# EAGLE design M5amigo-RS-485-MAX485 (EAGLE 9.6.2)

## Sheet 1 of 2
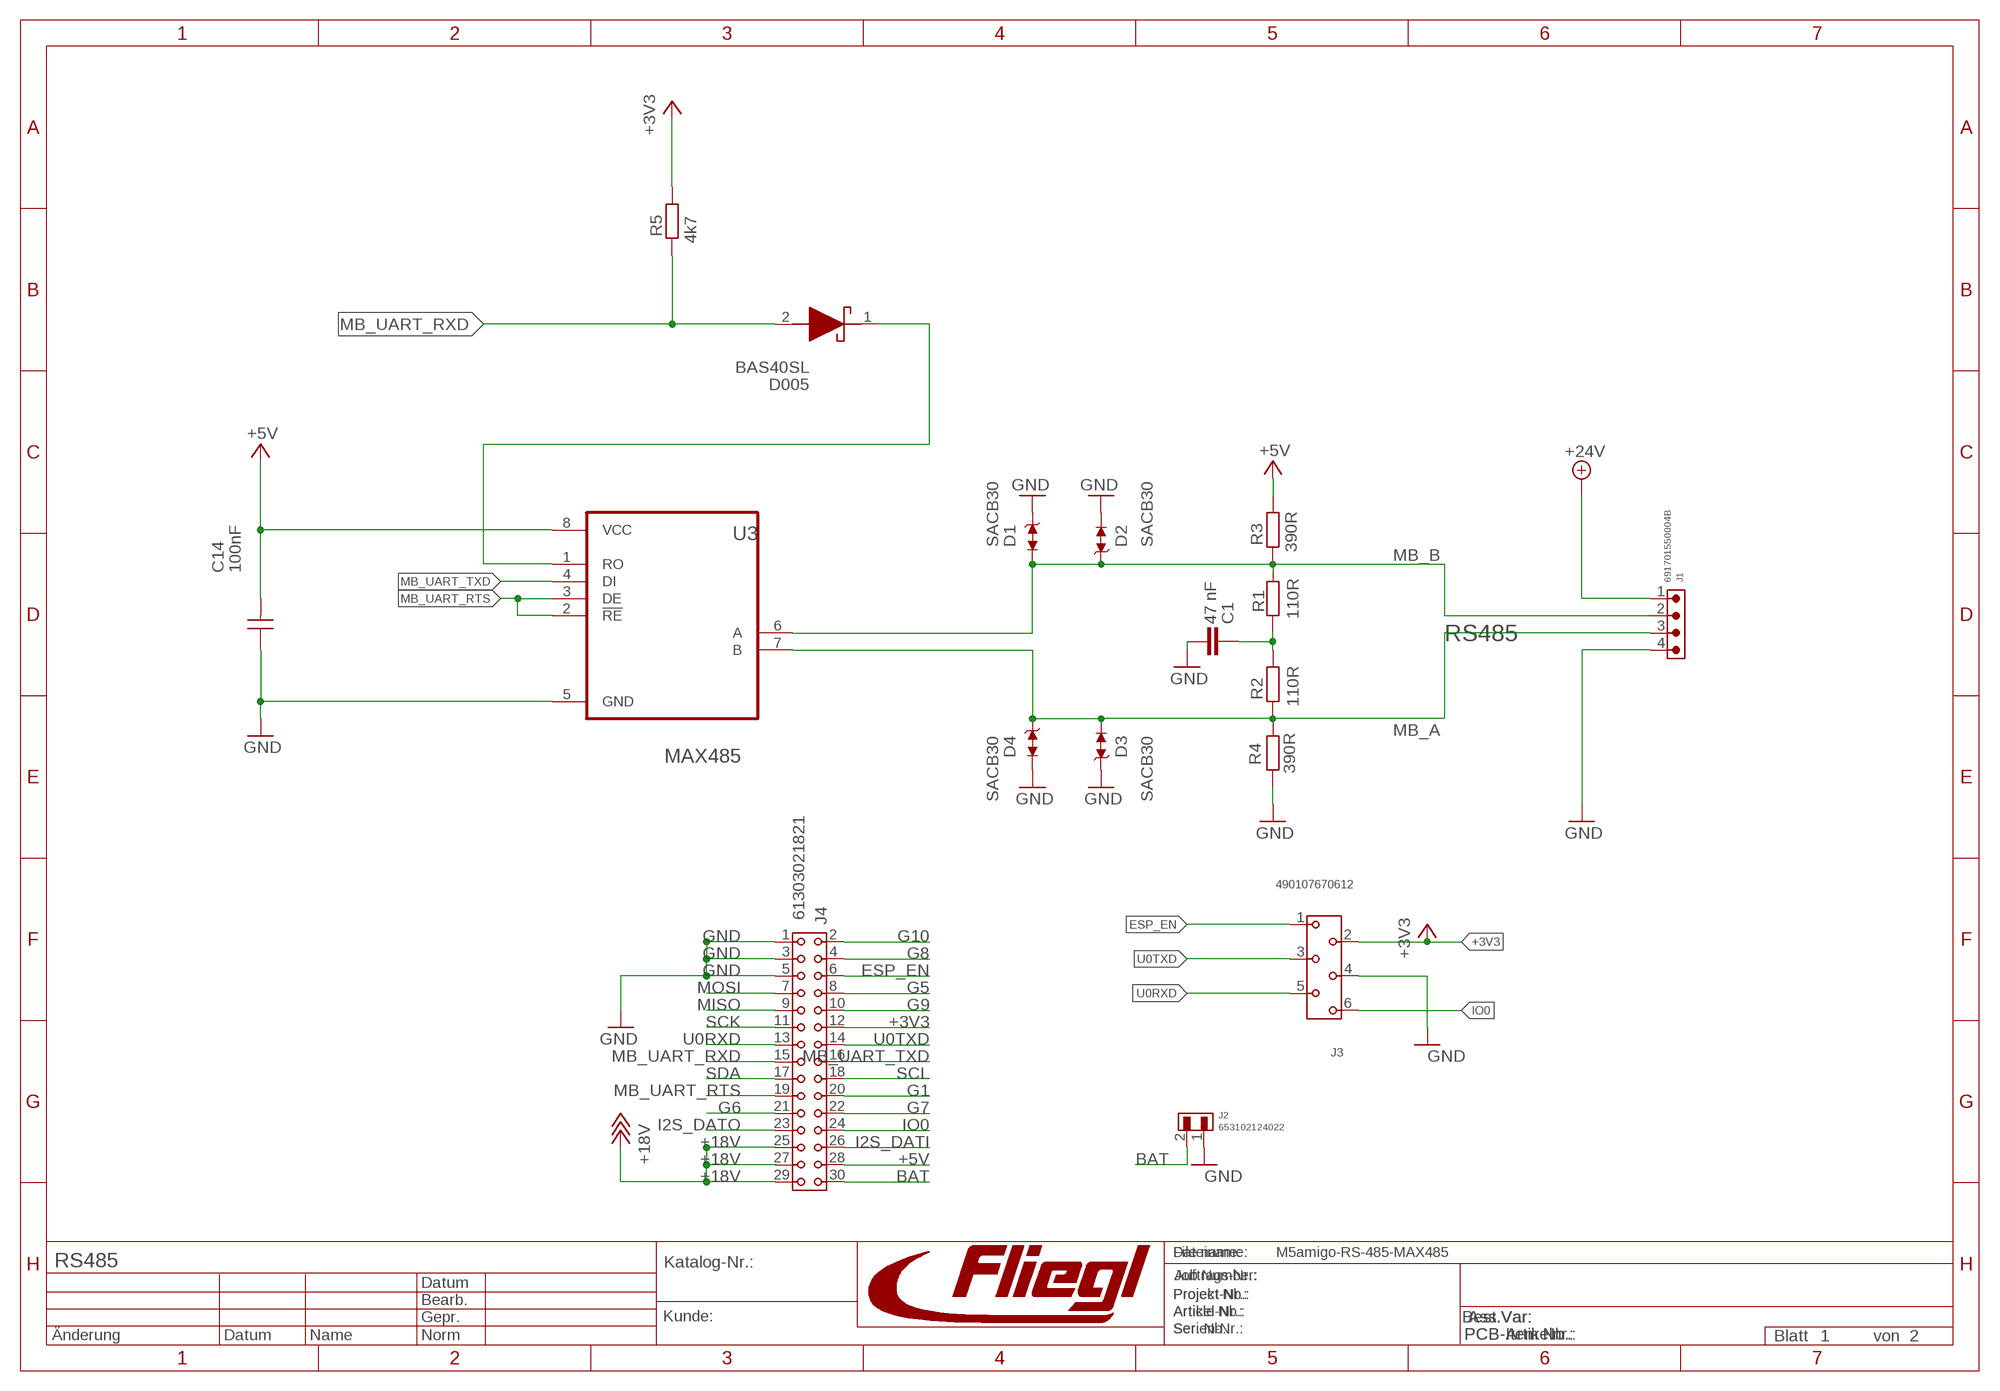
[diagram p0: schematic, sheet 1]
ZEICHNUNGSRAHMEN1 (RAHMEN_A4): FUNKTION: RS485

### Parts
C1  47 nF  WCAP-CSGP_0402_885012205054_25V(DC)  [WCAP-CSGP_0402]
C14  100nF  WCAP-CSGP_1206_H0.8_885012208087_50V(DC)  [WCAP-CSGP_1206_H0.8]
D1  SACB30  [DO214AA]
D2  SACB30  [DO214AA]
D3  SACB30  [DO214AA]
D4  SACB30  [DO214AA]
D005  BAS40SL  [SODFL1006X43N]
J1  691701550004B  [691701550004B]
J2  653102124022  [653102124022]
J3  490107670612  490107670612_DEBUGGING  [490107670612_DEBUGGING]
J4  61303021821  6130XX21821_61303021821  [61303021821]
R1  110R  R-0402_110R  [WCAP-CSRF_0402]
R2  110R  R-0402_110R  [WCAP-CSRF_0402]
R3  390R  R-0603_390R  [WCAP-CSMH_0603_R]
R4  390R  R-0603_390R  [WCAP-CSMH_0603_R]
R5  4k7  R-0603_390R  [WCAP-CSMH_0603_R]
U3  MAX485  MAX3485ECSA+T  [SOIC127P600X175-8N]

### Nets
+3V3: J3.2 J4.12 R5.2
+5V: C14.2 J4.28 R3.2 U3.8(VCC)
+18V: J4.25 J4.27 J4.29 ; also sheet 2
+24V: J1.1 ; also sheet 2
BAT: J2.2 J4.30
ESP_EN: J3.1 J4.6
G1: J4.20
G5: J4.8
G6: J4.21
G7: J4.22
G8: J4.4
G9: J4.10
G10: J4.2
GND [Versorgung]: C1.2 C14.1 D1.C(K) D2.A(KD) D3.C(K) D4.A(KD) J1.4 J2.1 J3.4 J4.1 J4.3 J4.5 R4.1 U3.5(GND) ; also sheet 2
I2S_DATI: J4.26
I2S_DATO: J4.23
IO0: J3.6 J4.24
MB_A: D3.A(KD) D4.C(K) J1.3 R2.1 R4.2 U3.7(B)
MB_B: D1.A(KD) D2.C(K) J1.2 R1.2 R3.1 U3.6(A)
MB_UART_RTS: J4.19 U3.2(!RE) U3.3(DE)
MB_UART_RXD: D005.2(A) J4.15 R5.1
MB_UART_TXD: J4.16 U3.4(DI)
MISO: J4.9
MOSI: J4.7
N$2: D005.1(K) U3.1(RO)
N$3: C1.1 R1.1 R2.2
SCK: J4.11
SCL: J4.18
SDA: J4.17
U0RXD: J3.5 J4.13
U0TXD: J3.3 J4.14

### Notes on the sheet
- RS485

## Sheet 2 of 2
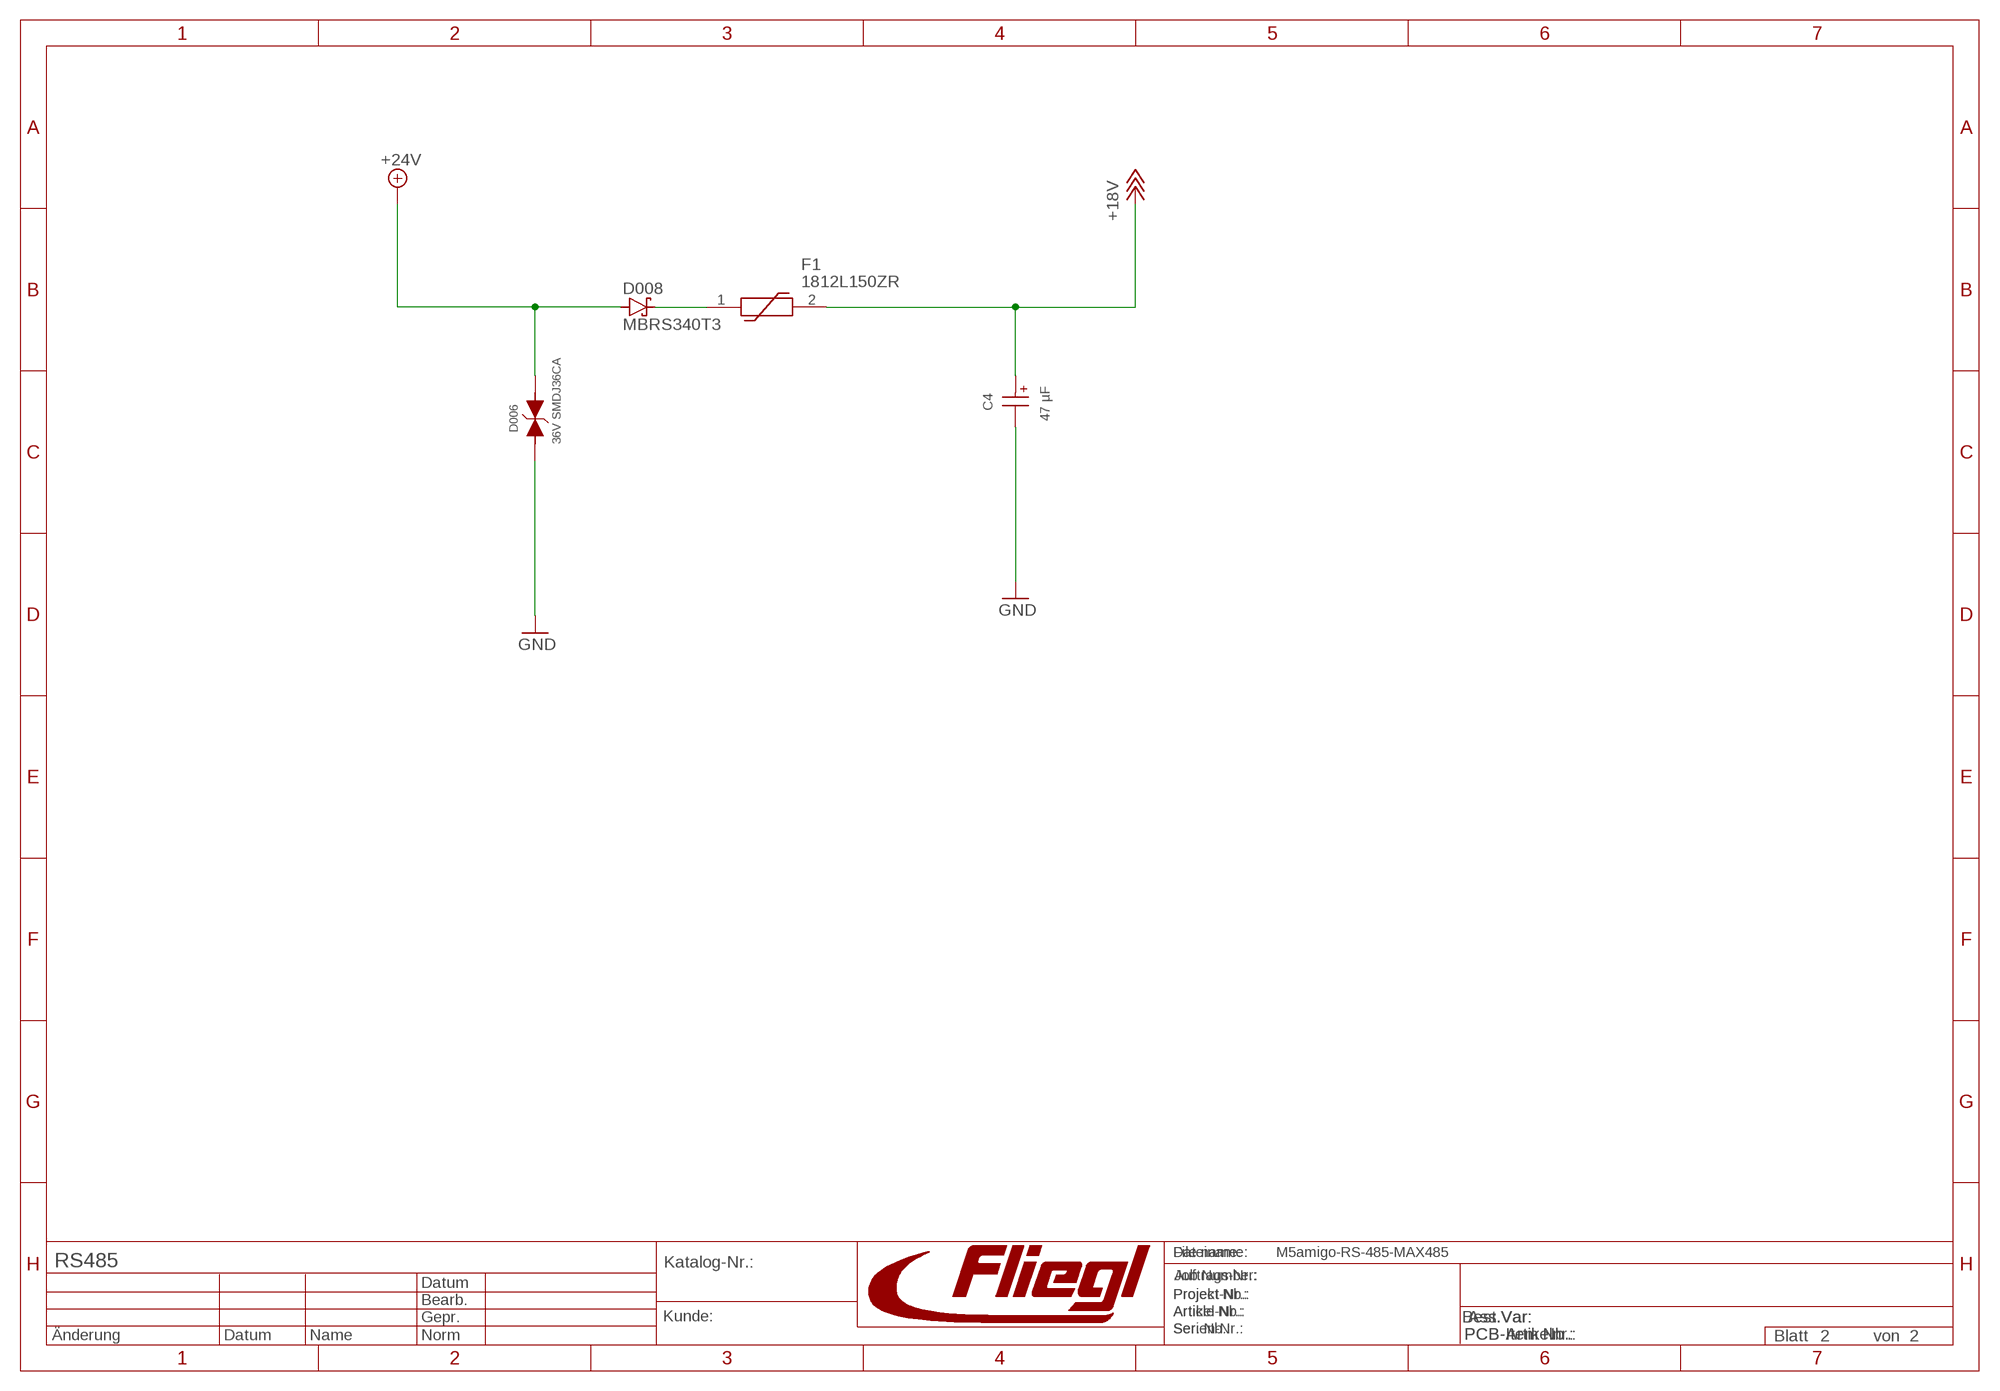
[diagram p1: schematic, sheet 2]
ZEICHNUNGSRAHMEN2 (RAHMEN_A4): FUNKTION: RS485

### Parts
C4  47 µF  WCAP-ASLL_6.3X7.7_865060645008  [WCAP-ASLL_6.3X7.7(DXL)]
D006  36V SMDJ36CA  WE-TVSP_DO-214AB_3000W_BI_824551361  [WE-TVSP_DO-214AB_BIDIRECTIONAL]
D008  MBRS340T3  [SMC]
F1  1812L150ZR  [1812L010DR]

### Nets
+18V: C4.1(+) F1.2 ; also sheet 1
+24V: D006.2 D008.A ; also sheet 1
GND [Versorgung]: C4.2(-) D006.1 ; also sheet 1
N$1: D008.C F1.1

## Library data of the parts
C1 = fliegl-wuerth:WCAP-CSGP_0402: WCAP-CSGP MLCCs 0402 General Purpose Characteristics High performance ceramic High electrical precision and stability ceramic especially for NP0 Minimal aging especially for NP0 Mounting style: SMT-Chip Ceramic: NP0 (Class I), X5R (Class II), X7R (Class II) Capacitance range: 1 pF ‒ 10 µF Temperature Coefficient: ±30 ppm/°C; ±0.54 % for NP0 ±15 % for X5R and X7R Voltage range (UR): 6.3 ‒ 100 V(DC) Operating temperature: -55 °C up to + 125 °C for NP0 and X7R -55 °C up to + 85 °C for X5R Termination: Cu/Ni/Sn Recommended soldering: Reflow soldering Applications Temperature compensation (NP0) Coupling Decoupling Bypass Smoothing Filtering Resonant circuit <https://www.we-online.com/catalog/media/o157810v209%20Family_WE-MLCC_0805_weiss.jpg> Details see: https://www.we-online.com/catalog/en/WCAP-CSGP-0402/ Updated by yingchun,Shan;2020-03-06 2020(C) Würth Elektronik; ARTIKEL_NR: 545508; CERAMIC-TYPE: X7R Class II; PART-NUMBER: 885012205054; TOL-VALUE: ±10%; VR: 25V(DC)
C4 = Wurth_Capacitors_WCAP-ASLL:WCAP-ASLL_6.3X7.7: WCAP-ASLL Aluminium Electrolytic Capacitors Low Impedance & Long Life +105 °C Characteristics Low impedance and long life product series Mounting style: V-Chip SMT Capacitance range: 1 µF ‒ 6800 µF Capacitance tolerance: ±20 % Voltage range (UR): 6.3 ‒ 450 V(DC) Operating temperature: -55 °C up to +105 °C for UR ≤ 100 V(DC) -40 °C up to +105 °C for UR > 100 V(DC) Endurance: 2000 ‒ 5000 h @ +105 °C Dimensions (DxL) in mm: 4.0 x 5.5 up to 16.0 x 17.0 Recommended soldering: Reflow soldering Applications Long life application & low impedance Input and output capacitor for switched-mode power supply Filtering Smoothing e.g. DC/DC converter, AC/DC converter, satellite receiver, control panel <https://www.we-online.com/catalog/media/o14724v209%20family-wcap-asll-5x5.5x1.4.jpg> Details see: www.we-online.com/catalog/WCAP-ASLL <www.we-online.com/catalog/WCAP-ASLL/?utm_source=eagle_model&utm_medium=description_link&utm_campaign=eisos_eagle> Updated by Ella 2022-12-06 2022(C) Würth Elektronik; DATASHEET-URL: https://www.we-online.com/redexpert/spec/865060645008?ae; DF: 12%; DIAMETER: 6.3mm; ENDURANCE: 2000h; I-LEAK: 23.5uA; I-RIPPLE: 185mA; L: 7.7mm; OPERATING-TEMPERATURE: -55 °C up to +105 °C; PART-NUMBER: 865060645008; TECHNICAL-REFERENCE: ASED077470M050DVCTCB000; VR: 50V (DC); Z: 680mohm
C14 = Eagle_WCAP-CSGP (rev22f):WCAP-CSGP_1206_H0.8: WCAP-CSGP MLCCs 1206 Characteristics General purpose product series High performance ceramic High electrical precision and stability ceramic especially for NP0 Minimal aging especially for NP0 Mounting style: SMT-Chip Ceramic: NP0 (Class I), X5R (Class II), X7R (Class II) Temperature coefficient: ±30 ppm/°C; ±0.54 % for NP0 ±15 % for X5R and X7R Operating temperature: -55 °C up to + 125 °C for NP0 and X7R -55 °C up to + 85 °C for X5R Termination: Cu/Ni/Sn Recommended soldering: Reflow soldering Wave soldering for size 0603 Wave soldering for size 0805 (only valid for the thickness ≤0.85 mm) Applications Temperature compensation (NP0) Coupling Decoupling Bypass Smoothing Filtering Resonant circuit <https://www.we-online.com/catalog/media/o177837v209%20MLCC_GRP_all.jpg> Details see: https://www.we-online.com/catalog/en/pbs/capacitors/multilayer_ceramic_chip_capacitors/mlcc_general_purpose Updated by yingchun,Shan;2020-03-09 2020(C) Würth Elektronik; CERAMIC-TYPE: X7R Class II; DATASHEET-URL: https://www.we-online.com/redexpert/spec/885012208087?ae; DF: 2.5%; HEIGHT: 0.8mm; MOUNT: SMT; OPERATING-TEMPERATURE: -55 up to +125 °C; PART-NUMBER: 885012208087; QMIN: -; RISO: 5GOhm; SIZE: 1206; TECHNICAL-REFERENCE: X7R1206104K050DFCT1000; VR: 50V(DC)
D1-D4 = fliegl-elektronik:SACB30: Transient Voltage Suppression DiodesSurface Mount – 500W > SACB series © 2016 Littelfuse, Inc. Datenblatt <https://www.littelfuse.com/~/media/electronics/datasheets/tvs_diodes/littelfuse_tvs_diode_sacb_datasheet.pdf.pdf>; ARTIKEL_NR: 543449
D005 = BAS40SL:BAS40SL: ON Semi BAS40SL SMT Schottky Diode, 40V 100mA, 2-Pin SOD-923F Source: Datasheet <http://www.onsemi.com/pub/Collateral/BAS40SL-D.pdf>; ARROW_PART_NUMBER: BAS40SL; ARROW_PRICE-STOCK: https://www.arrow.com/en/products/bas40sl/on-semiconductor; DESCRIPTION: ON Semi BAS40SL SMT Schottky Diode, 40V 100mA, 2-Pin SOD-923F; HEIGHT: 0.43mm; MANUFACTURER_NAME: onsemi; MANUFACTURER_PART_NUMBER: BAS40SL; MOUSER_PART_NUMBER: 512-BAS40SL; MOUSER_PRICE-STOCK: https://www.mouser.co.uk/ProductDetail/ON-Semiconductor-Fairchild/BAS40SL?qs=4aVxpR%2FL9VKq%2FbVf%2FOy3%2FQ%3D%3D
D006 = Wurth_EMC Components_WE-TVSP:WE-TVSP_DO-214AB_3000W_BI: WE-TVSP Power TVS Diode Characteristics Low Profile Package Glass passivated Juction Excellent clamping capability Fast response time MSL Level 1, per J-STD-020 Classification of the plastic case: UL 94 V-0 Safety certification UL 497B, E478010 Identical design: - DO-214AC = SMAJ - DO-214AA = SMBJ - DO-214AB = SMCJ/SMDJ Applications Ideal to protect the I/O Interfaces, Bus Voltage and other circuits of sensetive electronic equipment against voltage transiensts <https://www.we-online.com/catalog/media/o55793v209%20WE-TVSP_600W-3000W_D0214AA_4C.jpg> Details see: https://www.we-online.com/catalog/en/WE-TVSP/ Updated by Ella Wu 2020-07-20 2020 (C) Würth Elektronik; DATASHEET-URL: https://www.we-online.com/catalog/datasheet/824551361.pdf; IPEAK: 51.6A; MOUNT: SMT; PART-NUMBER: 824551361; PDISS: 3000W; VALUE: 36V; VBR: 42.1V; VCLAMP: 58.1V
D008 = fliegl-elektronik:MBRS3*0T3: SCHOTTKY BARRIER RECTIFIER 3.0 AMPERES 20, 30, 40 VOLT Source: MBRS340T3-D.pdf; ARTIKEL_NR: 513891
F1 = 1812L150ZR:1812L150ZR: LITTELFUSE - 1812L150ZR - PPTC Resettable Fuse, SMD, POLYFUSE 1812L Series, 1.5 A, 3 A, 8 VDC, -40 C Source: Datasheet <http://www.littelfuse.com/~/media/electronics/datasheets/resettable_ptcs/littelfuse_ptc_1812l_datasheet.pdf.pdf>; ARROW_PART_NUMBER: 1812L150ZR; ARROW_PRICE-STOCK: https://www.arrow.com/en/products/1812l150zr/littelfuse; DESCRIPTION: LITTELFUSE - 1812L150ZR - PPTC Resettable Fuse, SMD, POLYFUSE 1812L Series, 1.5 A, 3 A, 8 VDC, -40 C; HEIGHT: 1.25mm; MANUFACTURER_NAME: LITTELFUSE; MANUFACTURER_PART_NUMBER: 1812L150ZR; MOUSER_PART_NUMBER: 576-1812L150ZR; MOUSER_PRICE-STOCK: https://www.mouser.co.uk/ProductDetail/Littelfuse/1812L150ZR?qs=moO%2F8p2KOt9GMFPOVVFEqg%3D%3D
J1 = Wurth_Connectors_WR-TBL Pluggable Connector:691701550004B: WR-TBL Serie 7015B - 5.08 mm Closed Horizontal PCB Header THR Type with Flanges KIND PROPERTIES Pitch 5.08 mm MATERIAL PROPERTIES Insulator Material LCP Insulator Flammability Rating UL94 V-0 Contact Material Brass Contact Plating Tin GENERAL INFORMATION Operating Temperature -40 up to +105 °C Compliance RoHS ELECTRICAL PROPERTIES IR cULus 10 A Working Voltage [cULus] 300 V (AC) Withstanding Voltage [cULus] 4000 V (AC) Contact Resistance [cULus] 20 mΩ CERTIFICATION cULus Approval E315414 <https://www.we-online.com/catalog/media/o33337v209%20Family_WR-TBL_6917015500xxB.jpg> Details see: https://www.we-online.com/catalog/en/TBL_5_08_THR_7015B_CLOSE_HORIZONTAL_PCB_HEADER_W_FLANGES_69170155000XB/ Updated by Ella Wu 2019-12-30 2022(C) Wurth Elektronik; DATASHEET-URL: https://www.we-online.com/redexpert/spec/691701550004B?ae; IR-UL: 10A; MOUNT: THT; PART-NUMBER: 691701550004B; PINS: 4; PITCH: 5.08mm; TYPE: Horizontal; WORKING-VOLTAGE-UL: 300V (AC)
J2 = Wurth_Connectors_WR-WTB:653102124022: WR-WTB 1.25 mm SMT Male Vertical Shrouded Header KIND PROPERTIES: Pitch:1.25 mm Gender:Male MATERIAL PROPERTIES: Insulator Material :PA46 Insulator Flammability Rating:UL94 V-0 Color:Ivory Contact Material:Copper Alloy Contact Plating:Tin Contact Type:Stamped GENERAL INFORMATION Operating Temperature:-40 up to +85 °C Compliance: RoHS Working Voltage:125V (AC) Withstanding Voltage:250 V (AC) Contact Resistance:20 mΩ RISO:100 MΩ CERTIFICATION UL Approval:E323964 PACKAGING PROPERTIES Packaging:Tape and Reel <https://katalog.we-online.com/media/images/v2/o33372v209%20Family_WR-WTB_6531xx124022.jpg> Details see: https://katalog.we-online.com/en/em/WTB_1_25_SMT_MALE_VERTICAL_SHROUDED_HEADER_6531XX124022 Updated by Yingchun,Shan 2019-11-11 2019 (C) Würth Elektronik; CONTACT-RESISTANCE: 20mOhm; DATASHEET-URL: https://www.we-online.com/redexpert/spec/653102124022?ae; GENDER: Male; IR: 1A; L: 7.25mm; MOUNT: SMT; PACKAGING: Tape and Reel; PART-NUMBER: 653102124022; PCB-CABLE-PANEL: PCB; PINS: 2; PITCH: 1.25mm; TYPE: Vertical; WORKING-VOLTAGE: 125V(AC)
J3 = Wurth_Connectors_WR-WST:490107670612_DEBUGGING: WR-WST REDFIT IDC SKEDD Only use for debugging or programming application. For mechanical stressed application please use the PCB layout for permanent application PACKAGING PROPERTIES Packaging Tube ELECTRICAL PROPERTIES IR1 1 A RISO 1000 MΩ Withstanding Voltage 500 V (AC) Contact Resistance 10 mΩ PROPERTIES Insulator Material LCP Insulator Flammability Rating UL94 V-0 Insulator Color Black Contact Material CuNiSi Contact Plating Au (SKEDD), Sn (IDC) Pitch 2.54 mm Cable AWG 28/1.27 mm ribbon cable Operating Temperature -25 up to +105 °C Compliance Lead free / RoHS <https://katalog.we-online.com/media/images/v2/o104848v209%20Single_WR-WST_REDFIT.jpg> Details see: https://katalog.we-online.com/en/em/REDFIT_IDC_SKEDD Updated By Ella Wu 2019-05-21 2019 (C) Wurth Elektronik; CONTACT-RESISTANCE: 10mOhm; DATASHEET-URL: https://katalog.we-online.com/em/datasheet/490107670612.pdf; GENDER: Transition; IR: 1A; L: 15.21mm; PACKAGING: Tube; PART-NUMBER: 490107670612; PINS: 6; PITCH: 2.54mm; TOL-R: max.; USE-WITH: WR-CAB 1.27 mm Ribbon Flat Cable/WR-CAB 1.27 mm Ribbon Flat Cable 1 m pieces; WE-NUMBER: 490107670612; WORKING-VOLTAGE: 100V(AC)
J4 = Wurth_Connectors_WR-PHD:6130XX21821_61303021821: WR-PHD 2.54 mm Dual Socket Header ARTICLE PROPERTIES: Pins:4;​ 6;​ 8;​ 10;​ 12;​ 14;​ 16;​ 18;​ 20;​ 22;​ 24;​ 26;​ 28;​ 30;​ 32;​ 34;​ 36;​ 40;​ 44;​ 64;​ 72 KIND PROPERTIES: Pitch：2.54 mm Quality Class:3 as per CECC 75 301-802 Rows：Dual Gender：Socket Header Type：Straight MATERIAL PROPERTIES: Insulator Material :PBT Insulator Flammability Rating:UL94 V-0 Contact Material:Copper Alloy Contact Plating:Gold Contact Type:Stamped GENERAL INFORMATION Operating Temperature:-40 up to +125 °C Compliance:Lead free / RoHS ELECTRICAL PROPERTIES: Rated Current:3 A IR 1:3 A Withstanding Voltage:500 V (AC) Contact Resistance:20 mΩ RISO:1000 MΩ CERTIFICATION UL Approval:E323964 PACKAGING PROPERTIES Packaging:Tray <https://katalog.we-online.com/media/images/v2/o57948v209%20Family_Dual_Socket_Header_WR-PHD_6130xx21821.jpg> Details see: https://katalog.we-online.com/en/em/PHD_2_54_DUAL_SOCKET_HEADER_6130XX21821 Updated by Yingchun,Shan 2019-10-21 2019 (C) Würth Elektronik; DATASHEET-URL: https://www.we-online.com/redexpert/spec/61303021821?ae; GENDER: Socket Header; IR: 3A; MOUNT: THT; PACKAGING: Tray; PART-NUMBER: 61303021821; PINS: 30; PITCH: 2.54mm; ROWS: Dual; TYPE: Straight
R1 R2 = Resistor_smaller_fliegl:R-0402_: RESISTOR, European symbol; ARTIKEL_NR: 546993
R3 R4 = Resistor_smaller_fliegl:R-0603_; ARTIKEL_NR: 545595
R5 = Resistor_smaller_fliegl:R-0603_; ARTIKEL_NR: 545595; VALUE: 390R
U3 = MAX3485ECSA_T:MAX3485ECSA+T: Check availability <https://pricing.snapeda.com/parts/MAX3485ECSA%2BT/Analog%20Devices/view-part?ref=eda>; AVAILABILITY: In Stock; DESCRIPTION: 3.3V Powered, ±15kV ESD-Protected, 12Mbps, Slew-Rate-Limited True RS-485/RS-422 Transceivers; MF: Analog Devices; MP: MAX3485ECSA+T; PACKAGE: SOIC-8 Maxim; PRICE: None; PURCHASE-URL: https://pricing.snapeda.com/search/part/MAX3485ECSA+T/?ref=eda

## Net classes
0 default: width 0.2 mm, drill 0.02 mm, clearance 0.032 mm
1 Versorgung: width 0.2 mm, drill 0.02 mm, clearance 0.032 mm
2 ERDE: width 0.127 mm, clearance 0.4 mm to class 0, clearance 0.4 mm to class 1, clearance 0.4 mm

## Board
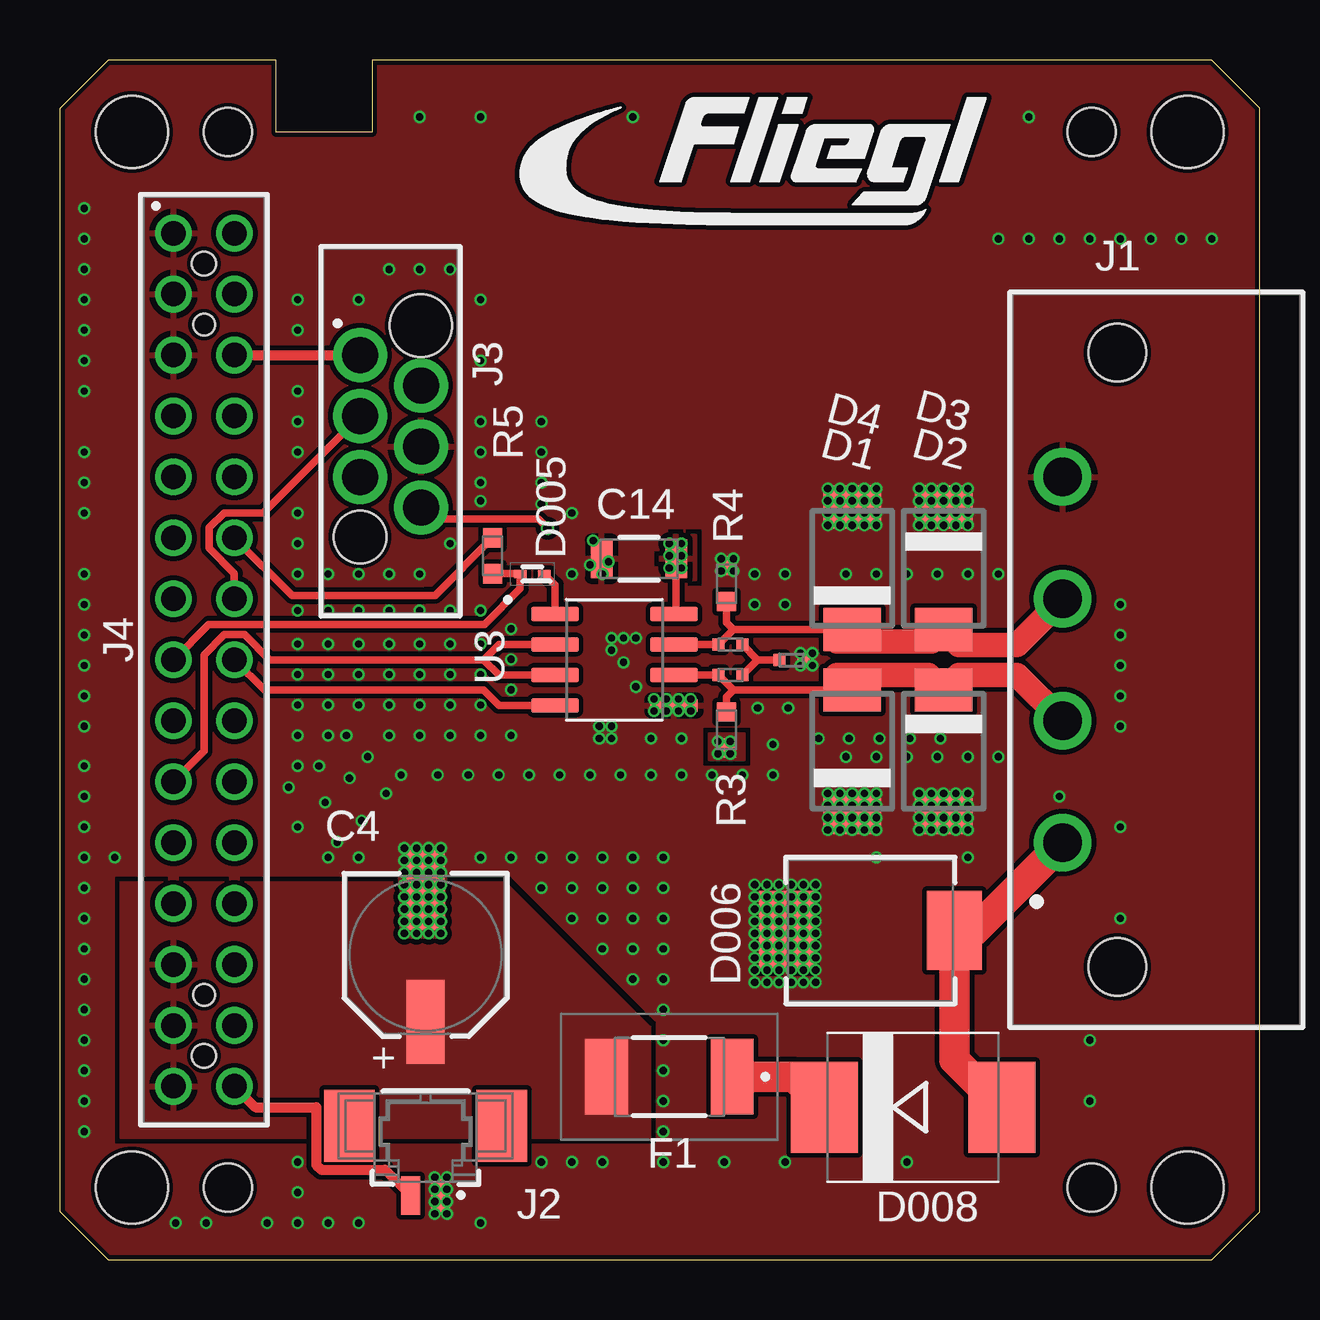
[diagram p2: board, top side]
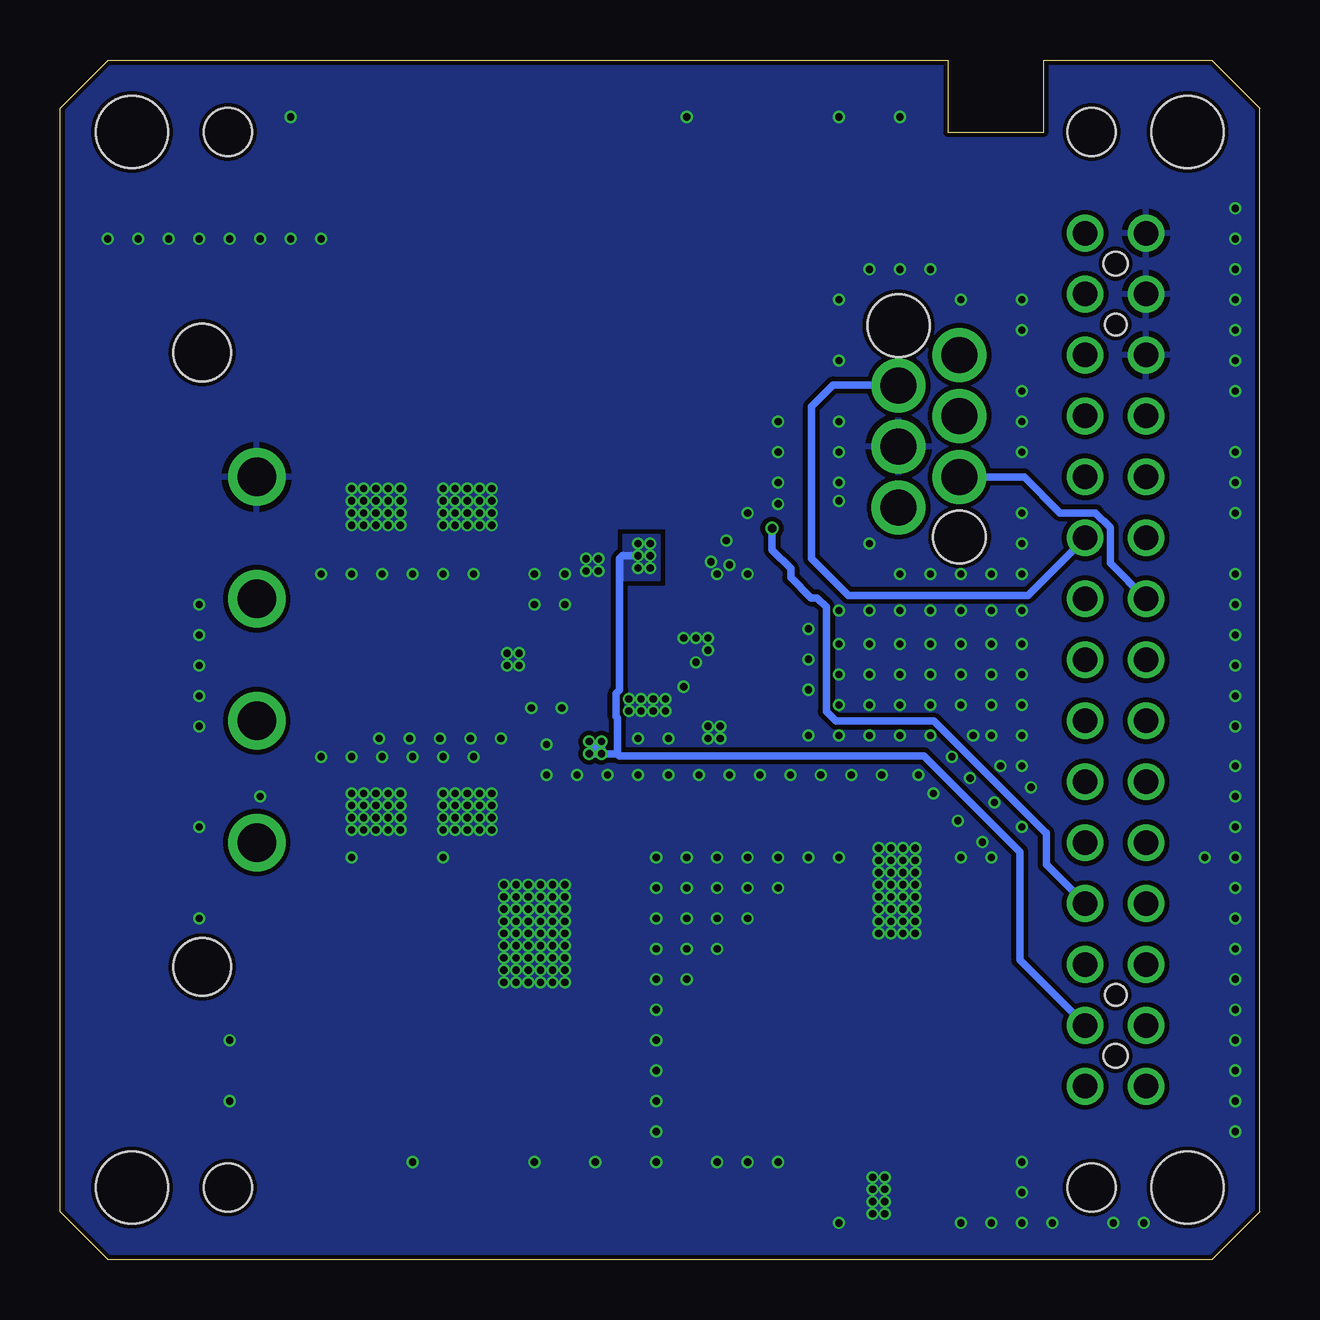
[diagram p3: board, bottom side, seen from below]

Size 50 x 50 mm. Coordinates in mm from the lower left corner, seen from the top.
Outline: 0,2 2,0 48,0 50,2 50,48 48,50 13,50 13,47 9,47 9,50 2,50 0,48 0,2
Copper layers (1*16): Top 0.035559375mm / dielectric 0.17018125mm / Bottom 0.035559375mm
Design rules "jlcpcb-4-layer *": minimum track width 5mil, minimum drill 0.2mm, track to track 0.126490625mm, track to pad 0.126490625mm, pad to pad 0.126490625mm, via to via 0.126490625mm, smd to smd 0mil, copper to edge 0.1mm, drill to drill 5mil, minimum pad ring 4mil, minimum via ring 4mil, stop-mask expansion 3mil, vias tented up to drill 100mil, thermal gap 10mil
Holes 3 mm at 3,3 3,47 47,47 47,3
Holes 2 mm at 7,3 7,47 43,47 43,3
Holes 1 mm at 6,41.51 6,8.49
Holes 0.9 mm at 6,38.97 6,11.03
Holes 2.4 mm at 44.08,37.8 44.08,12.2

### Footprints (pad centres in the part's own frame; a part is rotated, then mirrored left to right if it is on the bottom)
WCAP-CSGP_0402 = smd 0.5 x 0.5: 1 -0.5,0; 2 0.5,0
WCAP-ASLL_6.3X7.7(DXL) = smd 3.5 x 1.6: 1 2.8,0; 2 -2.8,0
WCAP-CSGP_1206_H0.8 = smd 0.9 x 1.6: 1 -1.55,0; 2 1.55,0
DO214AA = smd 1.8 x 2.4: A 2.55,0; C -2.55,0
SODFL1006X43N = smd 0.51 x 0.32: 1 -0.5,0; 2 0.5,0
WE-TVSP_DO-214AB_BIDIRECTIONAL = smd 2.3 x 3.3: 1 -3.5,0; 2 3.5,0
SMC = smd 2.8 x 3.8: A 3.7,0; C -3.7,0
1812L010DR = smd 1.78 x 3.15: 1 -2.615,0; 2 2.615,0
691701550004B = drill 1.6: 1 -7.62,0; 2 -2.54,0; 3 2.54,0; 4 7.62,0
653102124022 = smd 0.81 x 1.6: 1 -0.625,2.41; 2 0.625,2.41 | smd 2.1 x 3: Z1 -3.175,-0.49; Z2 3.175,-0.49
490107670612_DEBUGGING = drill 1.5 pad 1.825: 1 3.175,1.27; 2 1.905,-1.27; 3 0.635,1.27; 4 -0.635,-1.27; 5 -1.905,1.27; 6 -3.175,-1.27 | hole 2.2: -4.405,1.27 | hole 2.6: 4.405,-1.27
61303021821 = drill 1.02: 1 -17.78,-1.27; 2 -17.78,1.27; 3 -15.24,-1.27; 4 -15.24,1.27; 5 -12.7,-1.27; 6 -12.7,1.27; 7 -10.16,-1.27; 8 -10.16,1.27; 9 -7.62,-1.27; 10 -7.62,1.27; 11 -5.08,-1.27; 12 -5.08,1.27; 13 -2.54,-1.27; 14 -2.54,1.27; 15 0,-1.27; 16 0,1.27; 17 2.54,-1.27; 18 2.54,1.27; 19 5.08,-1.27; 20 5.08,1.27; 21 7.62,-1.27; 22 7.62,1.27; 23 10.16,-1.27; 24 10.16,1.27; 25 12.7,-1.27; 26 12.7,1.27; 27 15.24,-1.27; 28 15.24,1.27; 29 17.78,-1.27; 30 17.78,1.27
WCAP-CSRF_0402 = smd 0.5 x 0.5: 1 0.5,0; 2 -0.5,0
WCAP-CSMH_0603_R = smd 0.8 x 0.8: 1 -0.75,0; 2 0.75,0
SOIC127P600X175-8N = smd 1.97 x 0.59: 1 -2.475,1.905; 2 -2.475,0.635; 3 -2.475,-0.635; 4 -2.475,-1.905; 5 2.475,-1.905; 6 2.475,-0.635; 7 2.475,0.635; 8 2.475,1.905

### Placement (x,y rotation side)
C1  30.48,25 0 top
C4  15.24,12.7 270 top
C14  24.13,29.21 0 top
D1  33.02,21.19 90 top
D2  36.83,21.19 270 top
D3  36.83,28.81 270 top
D4  33.02,28.81 90 top
D005  19.68,28.57 180 top
D006  33.78,13.72 0 top
D008  35.56,6.35 0 top
F1  25.4,7.62 180 top
J1  41.8,25 90 top
J2  15.24,5.08 180 top
J3  13.78,34.52 90 top
J4  6,25 270 top
R1  27.94,24.36 0 top
R2  27.94,25.64 180 top
R3  27.78,22.08 270 top
R4  27.78,28.18 270 top
R5  18.03,29.34 90 top
U3  23.11,25 0 top
U$2  [FLIEGL_LOGO_19.5X5.3MM_TOP+TPLACE]  19.12,43.12 0 top

### Tracks (layer width: path | path; a pad name or v marks a point on that pad's centre or on a via)
+3V3
  Top 0.305: J4.12 9.67,27.68 15.24,27.68 15.63,27.68 R5.2
  Bottom 0.305: J4.12 9.66,27.69 17.14,27.69 18.67,29.21 18.67,35.56 17.78,36.45 15.06,36.45 J3.2
+5V  (via drill 0.3)
  Top 0.2: v25.91,29.84 25.7,29.63 25.61,29.63 25.45,29.63
  Top 0.305: C14.2 25.68,27 U3.8
  Bottom 0.305: J4.28 10,12.49 10,17 14,21 26.67,21 26.75,21.08 | v27.43,21.08 26.75,21.08 | v27.43,21.08 v27.43,21.59 | v27.43,21.08 v27.94,21.59 | v27.43,21.08 v27.94,21.08 | 26.75,21.08 26.75,22.57 26.82,22.64 26.82,23.59 26.67,23.74 26.67,29.21 26.54,29.34 v25.91,29.34
  other vias: 25.4,29.84 25.4,29.34 25.4,28.83 25.91,28.83
  pour Top (isolate 0.2, rank 5): 28.54,21.93 27.05,21.93 27.05,20.83 28.54,20.83
  pour Top (isolate 0.2, rank 5): 26.5,30.19 25.02,30.19 25.02,28.32 26.5,28.32
  pour Bottom (isolate 0.2, rank 5): 26.5,30.19 25.02,30.19 25.02,28.32 26.5,28.32
+18V
  pour Top (isolate 0.2, rank 5): 24.6,5.08 24.6,9.69 18.58,15.71 2.54,15.71 2.54,5.08
+24V
  Top 1.27: J1.1 38.14,13.72 D006.2 37.28,8.33 D008.A
BAT
  Top 0.406: J4.30 8.14,6.35 10.69,6.35 10.69,3.93 10.88,3.74 13.54,3.74 J2.2
ESP_EN
  Top 0.406: J4.6 J3.1
GND  (via drill 0.3)
  Top 0.305: C1.2 31.25,25.27 v31.37,25.27 | C1.2 30.86,25.12 v30.86,25.27 | C1.2 30.98,24.88 v30.86,24.77 | C1.2 31.21,24.77 v31.37,24.77
  other vias: 27.56,29.21 28.07,29.21 27.56,28.7 28.07,28.7 22.99,25.4 23.5,24.89 24,23.88 24,25.91 23.5,25.91 22.99,25.91 22.48,22.23 22.99,22.23 22.99,21.72 22.48,21.72 24.77,23.37 25.27,23.37 26.29,23.37 32,32.13 32,31.62 32,31.11 32,30.61 32.51,30.61 33.02,30.61 33.53,30.61 34.04,30.61 32.51,32.13 33.02,32.13 33.53,32.13 34.04,32.13 34.04,31.62 33.53,31.62 33.02,31.62 32.51,31.62 32.51,31.11 33.02,31.11 33.53,31.11 34.04,31.11 35.81,32.13 35.81,31.62 35.81,31.11 35.81,30.61 36.32,30.61 36.83,30.61 37.34,30.61 37.85,30.61 36.32,32.13 36.83,32.13 37.34,32.13 37.85,32.13 37.85,31.62 37.34,31.62 36.83,31.62 36.32,31.62 36.32,31.11 36.83,31.11 37.34,31.11 37.85,31.11 32,19.43 32,18.92 32,18.41 32,17.91 32.51,17.91 33.02,17.91 33.53,17.91 34.04,17.91 32.51,19.43 33.02,19.43 33.53,19.43 34.04,19.43 34.04,18.92 33.53,18.92 33.02,18.92 32.51,18.92 32.51,18.41 33.02,18.41 33.53,18.41 34.04,18.41 35.81,19.43 35.81,18.92 35.81,18.41 35.81,17.91 36.32,17.91 36.83,17.91 37.34,17.91 37.85,17.91 36.32,19.43 36.83,19.43 37.34,19.43 37.85,19.43 37.85,18.92 37.34,18.92 36.83,18.92 36.32,18.92 36.32,18.41 36.83,18.41 37.34,18.41 37.85,18.41 29.46,13.08 29.46,12.57 29.46,12.06 29.46,11.56 29.97,11.56 30.48,11.56 30.99,11.56 31.5,11.56 29.97,13.08 30.48,13.08 30.99,13.08 31.5,13.08 31.5,12.57 30.99,12.57 30.48,12.57 29.97,12.57 29.97,12.06 30.48,12.06 30.99,12.06 31.5,12.06 29.46,15.62 29.46,15.11 29.46,14.61 29.46,14.1 29.97,14.1 30.48,14.1 30.99,14.1 31.5,14.1 29.97,15.62 30.48,15.62 30.99,15.62 31.5,15.62 31.5,15.11 30.99,15.11 30.48,15.11 29.97,15.11 29.97,14.61 30.48,14.61 30.99,14.61 31.5,14.61 29.46,13.59 29.97,13.59 30.48,13.59 30.99,13.59 31.5,13.59 28.96,15.62 28.96,15.11 28.96,14.61 28.96,14.1 28.96,13.59 28.96,13.08 28.96,12.57 28.96,11.56 28.96,12.06 15.62,3.43 16.13,3.43 15.62,2.92 16.13,2.92 16.13,2.41 15.62,2.41 15.62,1.91 16.13,1.91 14.35,15.11 14.86,15.11 15.37,15.11 15.88,15.11 15.88,15.62 15.88,16.13 15.88,16.64 15.88,17.14 14.35,15.62 14.35,16.13 14.35,16.64 14.35,17.14 14.86,17.14 14.86,16.64 14.86,16.13 14.86,15.62 15.37,15.62 15.37,16.13 15.37,16.64 15.37,17.14 14.35,14.61 14.35,14.1 14.35,13.59 15.88,14.61 15.37,14.61 14.86,14.61 14.86,14.1 14.86,13.59 15.37,14.1 15.88,14.1 15.88,13.59 15.37,13.59 16.26,25.65 16.26,24.38 14.99,25.65 14.99,24.38 13.72,25.65 13.72,24.38 14.99,23.11 13.72,23.11 17.53,23.11 21.34,28.57 22.61,28.57 22.1,28.96 12.45,24.38 12.45,25.65 11.18,25.65 11.18,24.38 12.45,23.11 11.18,23.11 9.91,23.11 9.91,24.38 9.91,25.65 17.53,25.65 32.77,28.57 36.58,28.57 36.58,20.95 32.77,20.95 34.04,20.95 35.31,20.95 34.04,28.57 35.31,28.57 37.85,28.57 39.12,28.57 37.85,20.95 39.12,20.95 44.2,27.3 44.2,26.04 44.2,24.77 44.2,23.5 44.2,22.23 28.96,27.3 30.23,27.3 29.08,22.99 30.35,22.99 31.62,21.72 32.89,21.72 34.16,21.72 35.43,21.72 36.7,21.72 25.78,23.37 25.91,21.72 25.91,20.19 27.18,20.19 28.45,20.19 29.72,20.19 29.72,21.46 24.64,21.72 24.64,20.19 23.37,20.19 22.1,20.19 20.83,20.19 19.56,20.19 18.29,20.19 16.26,23.11 17.53,24.38 9.91,21.84 9.91,20.57 9.53,19.68 9.91,18.03 11.18,16.76 12.45,16.76 17.53,16.76 18.8,16.76 20.07,16.76 21.34,16.76 22.61,16.76 23.88,16.76 25.15,16.76 25.15,15.49 25.15,14.22 25.15,12.95 25.15,11.68 25.15,10.41 25.15,9.14 25.15,7.87 25.15,6.6 25.15,5.33 25.15,4.06 22.61,4.06 21.34,4.06 20.07,4.06 9.91,4.06 1.02,6.6 1.02,9.14 1.02,11.68 1.02,10.41 1.02,7.87 1.02,5.33 9.91,2.79 9.91,1.52 11.18,1.52 12.45,1.52 17.53,1.52 2.29,16.76 1.02,15.49 1.02,14.22 1.02,12.95 27.69,4.06 30.23,4.06 35.31,4.06 42.93,6.6 42.93,9.14 44.2,14.22 44.2,18.03 41.66,19.3 37.85,16.76 34.04,16.76 14.99,47.62 17.53,47.62 23.88,47.62 40.39,47.62 48.01,42.55 1.02,43.81 1.02,42.55 1.02,41.27 1.02,40.01 1.02,38.73 1.02,37.47 1.02,36.2 1.02,33.66 1.02,32.38 1.02,31.11 1.02,28.57 1.02,27.3 1.02,26.04 1.02,22.23 17.53,31.62 17.53,32.38 17.53,33.66 17.53,34.92 17.53,37.47 20.07,34.92 20.07,33.66 20.07,32.38 21.34,31.11 16.26,29.84 14.99,28.57 13.72,28.57 11.18,28.57 9.91,28.57 12.45,28.57 9.91,27.05 11.18,27.05 12.45,27.05 13.72,27.05 14.99,27.05 16.26,27.05 17.53,27.05 14.99,21.84 16.26,21.84 17.53,21.84 18.8,21.84 13.72,21.84 11.18,21.84 12.83,20.95 12.06,20.07 11.05,19.05 10.79,20.57 11.94,21.84 14.22,20.19 13.59,19.43 12.57,18.29 11.56,17.4 17.02,20.19 15.75,20.19 22.86,29.08 22.23,29.97 28.96,28.57 30.23,28.57 20.07,31.5 9.91,40.01 9.91,38.73 9.91,36.2 9.91,34.92 9.91,33.66 9.91,31.11 9.91,29.84 17.53,40.01 12.45,40.01 13.72,41.27 14.99,41.27 16.26,41.27 46.74,42.55 45.47,42.55 44.2,42.55 42.93,42.55 41.66,42.55 40.39,42.55 39.12,42.55 21.34,14.22 22.61,12.95 23.88,11.68 20.07,15.49 21.34,15.49 22.61,14.22 23.88,12.95 22.61,15.49 23.88,15.49 23.88,14.22 1.02,18.03 1.02,16.76 1.02,19.3 1.02,20.57 1.02,23.5 1.02,24.77 8.64,1.52 4.83,1.52 6.1,1.52 24.77,22.86 25.27,22.86 25.78,22.86 26.29,22.86 18.8,25.02 18.8,26.29 18.8,23.75
  pour Bottom (isolate 0.2, rank 6): 50,50 0,50 0,0 50,0
  pour Top (isolate 0.2, rank 6): 50,50 0,50 0,0 50,0
IO0  (via drill 0.35)
  Top 0.305: v20.32,30.48 19.94,30.86 15.53,30.86 J3.6
  Bottom 0.305: J4.24 8.89,16.46 8.89,17.78 8.9,17.78 13.57,22.45 17.65,22.45 18.06,22.85 18.06,27.19 18.45,27.58 18.69,27.58 19.54,28.43 19.54,28.8 20.32,29.58 v20.32,30.48
MB_A
  Top 0.305: D4.C 28.07,26.26 | 28.07,26.26 R2.1 U3.7 | R4.2 27.78,26.54 28.07,26.26
  Top 1.016: J1.3 39.88,25.62 37.47,25.62 D3.A 36.32,25.75 32.38,25.75 32.89,26.26 D4.C
MB_B
  Top 0.305: D1.A 28.07,23.74 | 28.07,23.74 R1.2 U3.6 | R3.1 27.78,23.46 28.07,23.74
  Top 1.016: J1.2 39.88,24.38 37.47,24.38 D2.C 36.2,24.38 32.38,24.38 D1.A
MB_UART_RTS
  Top 0.305: J4.19 6,21.19 6,25.21 6.84,26.04 7.7,26.04 8.75,25 17.66,25 | 17.66,25 18.3,24.36 U3.3 | 17.66,25 18.3,25.64 U3.2
MB_UART_RXD
  Top 0.305: J4.15 6.21,26.48 17.7,26.48 19.18,27.96 D005.2 19.17,28.59 R5.1
MB_UART_TXD
  Top 0.305: J4.16 8.53,23.74 17.65,23.74 18.3,23.09 U3.4
N$1
  Top 1.27: D008.C 30.59,7.62 F1.1
N$2
  Top 0.305: D005.1 20.64,28.12 U3.1
N$3
  Top 0.305: 29.07,25 R2.2 | C1.1 29.07,25 | 29.07,25 R1.1
U0RXD
  Bottom 0.305: J3.5 9.81,32.62 8.31,31.12 6.84,31.12 6.23,30.51 6.23,29.04 J4.13
U0TXD
  Top 0.305: J3.3 8.47,31.12 6.84,31.12 6.23,30.51 6.23,29.65 7.27,28.6 J4.14

### Text on the board
_tNames: J1 | J3 | D4 | D3 | R5 | D1 | D2 | D005 | C14 | R4 | J4 | U3 | C4 | R3 | D006 | F1 | J2 | D008